# Altium schematic sheet CPUboard.SchDoc
size A2
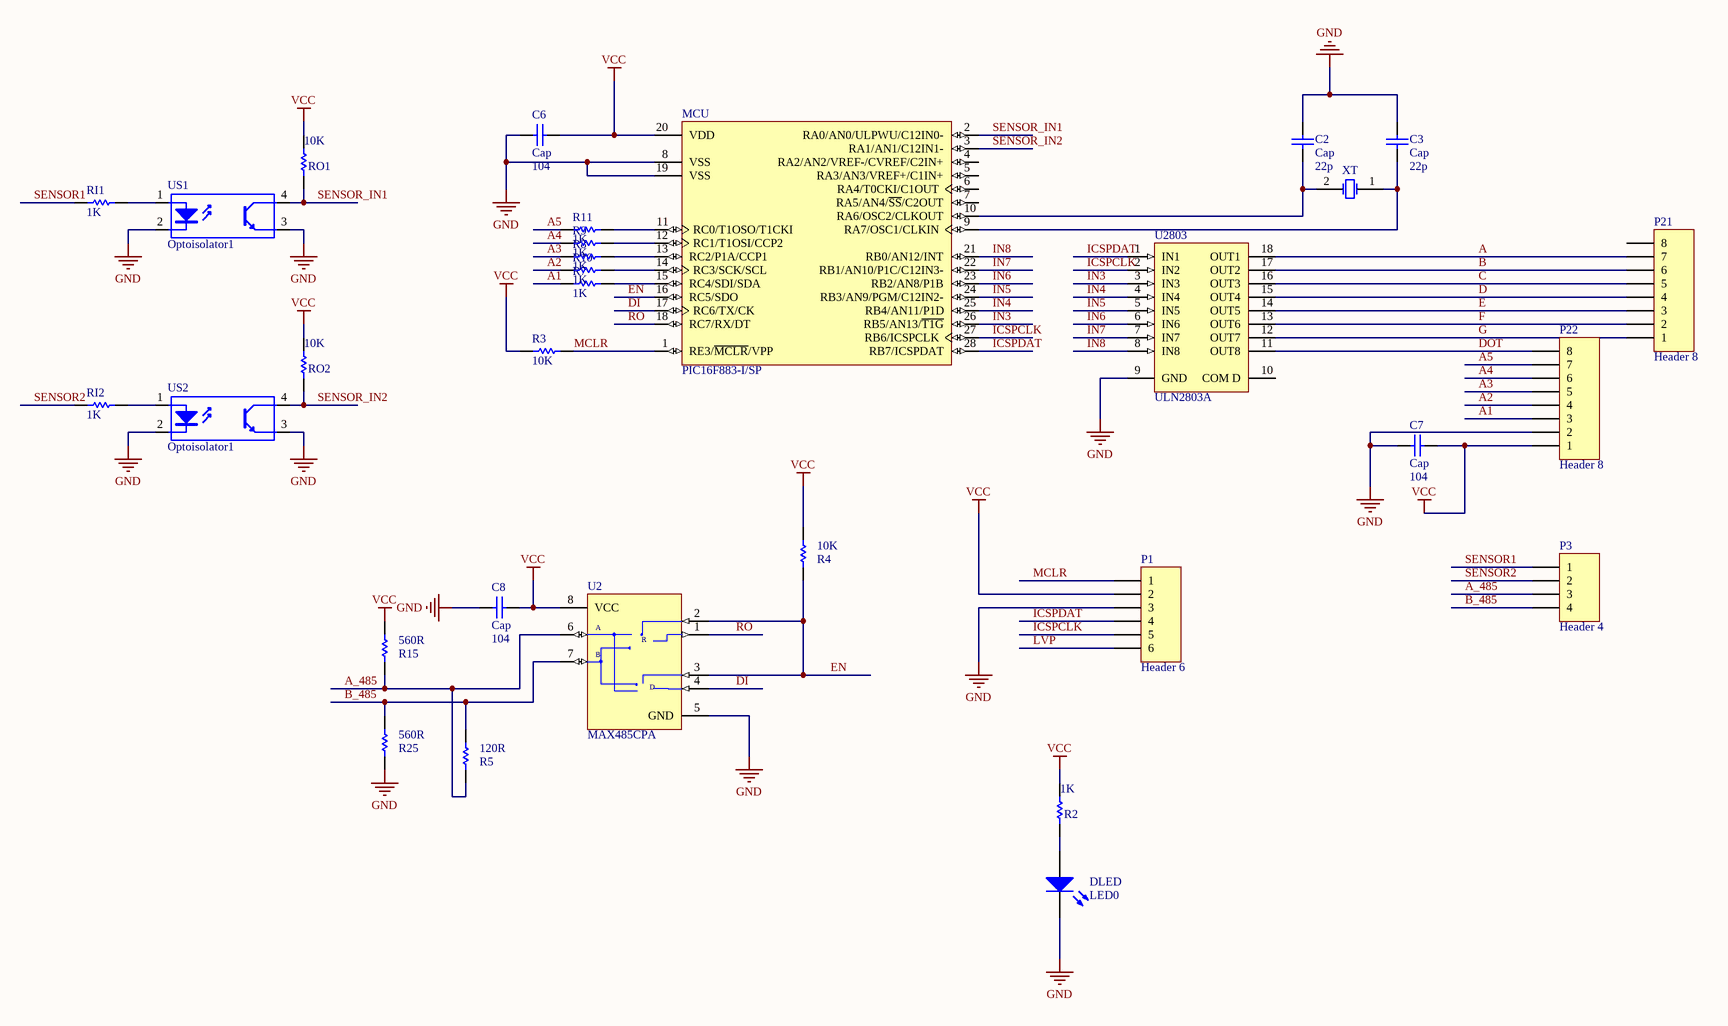
[diagram p0: CPUboard.SchDoc]

## Parts
C2  Cap  value 22p  [tu_gom]
C3  Cap  value 22p  [tu_gom]
C6  Cap  value 104  [tu_gom]
C7  Cap  value 104  [tu_gom]
C8  Cap  value 104  [tu_gom]
DLED  LED0  [LED_3]
MCU  PIC16F883-I/SP  [SPDIP300-SP28]
P1  Header 6  [HDR1X6]
P3  Header 4  [CAP 4]
P21  Header 8  [Cap_8]
P22  Header 8  [Cap_8]
R2  1K  [R_Nor]
R3  10K  [R_Nor]
R4  10K  [R_Nor]
R5  120R  [R_Nor]
R7  1K  [R_Nor]
R8  1K  [R_Nor]
R9  1K  [R_Nor]
R10  1K  [R_Nor]
R11  1K  [R_Nor]
R15  560R  [R_Nor]
R25  560R  [R_Nor]
RI1  1K  [R_Nor]
RI2  1K  [R_Nor]
RO1  10K  [R_Nor]
RO2  10K  [R_Nor]
U2  MAX485CPA  [PA8]
U2803  ULN2803A  [DIP18]
US1  Optoisolator1  [Opto]
US2  Optoisolator1  [Opto]
XT  XTAL  [Xtal12M]  (value not drawn)

## Nets
GND: C2.2 C3.2 C6.2 C7.1 C8.1 DLED.2(K) MCU.8(VSS) MCU.19(VSS) P1.3 P22.2 R25.1 U2.5(GND) U2803.9(GND) US1.2(K) US1.3(E) US2.2(K) US2.3(E)
VCC: C6.1 C7.2 C8.2 MCU.20(VDD) P1.2 P22.1 R2.2 R3.2 R4.2 R15.2 RO1.2 RO2.2 U2.8(VCC)
A: P21.7 U2803.18(OUT1)
A1: P22.3 R7.2
A2: P22.4 R10.2
A3: P22.5 R8.2
A4: P22.6 R9.2
A5: P22.7 R11.2
A_485: P3.3 R5.1 R15.1 U2.6(A)
B: P21.6 U2803.17(OUT2)
B_485: P3.4 R5.2 R25.2 U2.7(B)
C: P21.5 U2803.16(OUT3)
D: P21.4 U2803.15(OUT4)
DI: MCU.17(RC6/TX/CK) U2.4(DI)
DOT: P22.8 U2803.11(OUT8)
E: P21.3 U2803.14(OUT5)
EN: MCU.16(RC5/SDO) R4.1 U2.2(~{RE}) U2.3(DE)
F: P21.2 U2803.13(OUT6)
G: P21.1 U2803.12(OUT7)
ICSPCLK: MCU.27(RB6/ICSPCLK) P1.5 U2803.2(IN2)
ICSPDAT: MCU.28(RB7/ICSPDAT) P1.4 U2803.1(IN1)
IN3: MCU.26(RB5/AN13/~{T1G}) U2803.3(IN3)
IN4: MCU.25(RB4/AN11/P1D) U2803.4(IN4)
IN5: MCU.24(RB3/AN9/PGM/C12IN2-) U2803.5(IN5)
IN6: MCU.23(RB2/AN8/P1B) U2803.6(IN6)
IN7: MCU.22(RB1/AN10/P1C/C12IN3-) U2803.7(IN7)
IN8: MCU.21(RB0/AN12/INT) U2803.8(IN8)
LVP: P1.6
MCLR: MCU.1(RE3/~{MCLR}/VPP) P1.1 R3.1
RO: MCU.18(RC7/RX/DT) U2.1(RO)
SENSOR1: P3.1 RI1.2
SENSOR2: P3.2 RI2.2
SENSOR_IN1: MCU.2(RA0/AN0/ULPWU/C12IN0-) RO1.1 US1.4(C)
SENSOR_IN2: MCU.3(RA1/AN1/C12IN1-) RO2.1 US2.4(C)
NetC2_1: C2.1 MCU.10(RA6/OSC2/CLKOUT) XT.2(OSC2)
NetC3_1: C3.1 MCU.9(RA7/OSC1/CLKIN) XT.1(OSC1)
NetDLED_1: DLED.1(A) R2.1
NetMCU_11: MCU.11(RC0/T1OSO/T1CKI) R11.1
NetMCU_12: MCU.12(RC1/T1OSI/CCP2) R9.1
NetMCU_13: MCU.13(RC2/P1A/CCP1) R8.1
NetMCU_14: MCU.14(RC3/SCK/SCL) R10.1
NetMCU_15: MCU.15(RC4/SDI/SDA) R7.1
NetRI1_1: RI1.1 US1.1(A)
NetRI2_1: RI2.1 US2.1(A)

Not connected (* = marked no-connect by the designer): MCU 4(RA2/AN2/VREF-/CVREF/C2IN+) 5(RA3/AN3/VREF+/C1IN+) 6(RA4/T0CKI/C1OUT) 7(RA5/AN4/~{SS}/C2OUT); P21 8; U2803 10(COM_D)

## Notes on the sheet
- (in symbol MAX485CPA) R; D

## Library data of the parts
C2 C3 C6-C8 = Ceramic: Capcitor
DLED = LED0: Typical INFRARED GaAs LED; Published: 8-Jun-2000; LatestRevisionDate: 08-Jul-2005; LatestRevisionNote: Mech Layer 1 removed.; PackageReference: LED-0; Publisher: Altium Limited
MCU = PIC16F883-I/SP: Flash-Based, 8-Bit CMOS Microcontroller with nanoWatt Technology, 4K (x14-Bit words) Program Memory, 512 Bytes Data Memory, 24 I/O pins, 28-Pin SPDIP, Standard VDD Range, Industrial Temperature; FirstPublished: 29-Jan-2009; LatestRevisionDate: 02-Dec-2009; LatestRevisionNote: Updated datasheet to version revF, Apr-2009.; DatasheetVersion: revF, Apr-2009; PackageVersion: revBB, Aug-2009; PackageReference: SPDIP300-SP28; Publisher: Altium Limited; PackageDescription: 28-Lead Skinny Plastic Dual In-Line (SP) - 300 mil Body [SPDIP]; Supplier 1: Digi-Key; Supplier Part Number 1: PIC16F883-I/SP-ND; Supplier 2: Farnell; Supplier Part Number 2: 1439533; Supplier 3: Newark; Supplier Part Number 3: 74K8558; ComponentLink1Description: Datasheet; ComponentLink1URL: http://ww1.microchip.com/downloads/en/DeviceDoc/41291F.pdf; ComponentLink2Description: Packaging Specification; ComponentLink2URL: http://www.microchip.com/stellent/groups/techpub_sg/documents/packagingspec/en012702.pdf; ComponentLink3Description: Microchip.com Home; ComponentLink3URL: http://www.microchip.com/
P1 = Header 6: Header, 6-Pin; LatestRevisionDate: 17-Jul-2002; LatestRevisionNote: Re-released for DXP Platform.; Publisher: Altium Limited
P3 = Header 4: Header, 4-Pin; LatestRevisionDate: 17-Jul-2002; LatestRevisionNote: Re-released for DXP Platform.; Publisher: Altium Limited
P21 P22 = Header 8: Header, 8-Pin; LatestRevisionDate: 17-Jul-2002; LatestRevisionNote: Re-released for DXP Platform.; Publisher: Altium Limited
R2-R5 R7-R11 R15 R25 RI1 RI2 RO1 RO2 = Res
U2 = MAX485CPA: Low-Power, Slew-Rate-Limited RS-485/RS-422 Transceiver; Published: 16-Jan-2001; LatestRevisionDate: 29-May-2009; LatestRevisionNote: Component Body Added.; DatasheetVersion: Feb-1996; PackageVersion: RevB, 21-0043; PackageReference: PA8; Publisher: Altium Limited; PackageDescription: DIP, 8-Pin, Row Spacing 7.62 mm, Pitch 2.54 mm; Code_JEDEC: MS-001-AB; ComponentLink1Description: Manufacturer Link; ComponentLink1URL: http://www.maxim-ic.com/; ComponentLink2Description: Datasheet; ComponentLink2URL: http://pdfserv.maxim-ic.com/en/ds/MAX1487-MAX491.pdf
U2803 = ULN2803A: Eight Darlington Array; Published: 8-Jun-2000; LatestRevisionDate: 06-Jun-2005; LatestRevisionNote: Stylized 3D Model Added.; DatasheetVersion: Sep-1997; PackageReference: DIP18; Publisher: Altium Limited; PackageDescription: DIP; 18 Leads; Row Spacing 7.62 mm; Pitch 2.54 mm; ComponentLink1Description: Manufacturer Link; ComponentLink1URL: http://www.st.com/; ComponentLink2Description: Datasheet; ComponentLink2URL: http://www.st.com/stonline/products/literature/ds/1536/uln2801a.pdf
US1 US2 = Optoisolator1: 4-Pin Phototransistor Optocoupler; Published: 24-Mar-1999; LatestRevisionDate: 04-Mar-2005; LatestRevisionNote: Sch pins 3 & 4 Swapped.; DatasheetVersion: Nov-2003; PackageReference: DIP-4; Publisher: Altium Limited
XT = XTAL: Crystal Oscillator; Published: 8-Jun-2000; LatestRevisionDate: 17-Jul-2002; LatestRevisionNote: Re-released for DXP Platform.; PackageReference: R38; Publisher: Altium Limited